# EAGLE design relay_control (EAGLE 9.6.2)
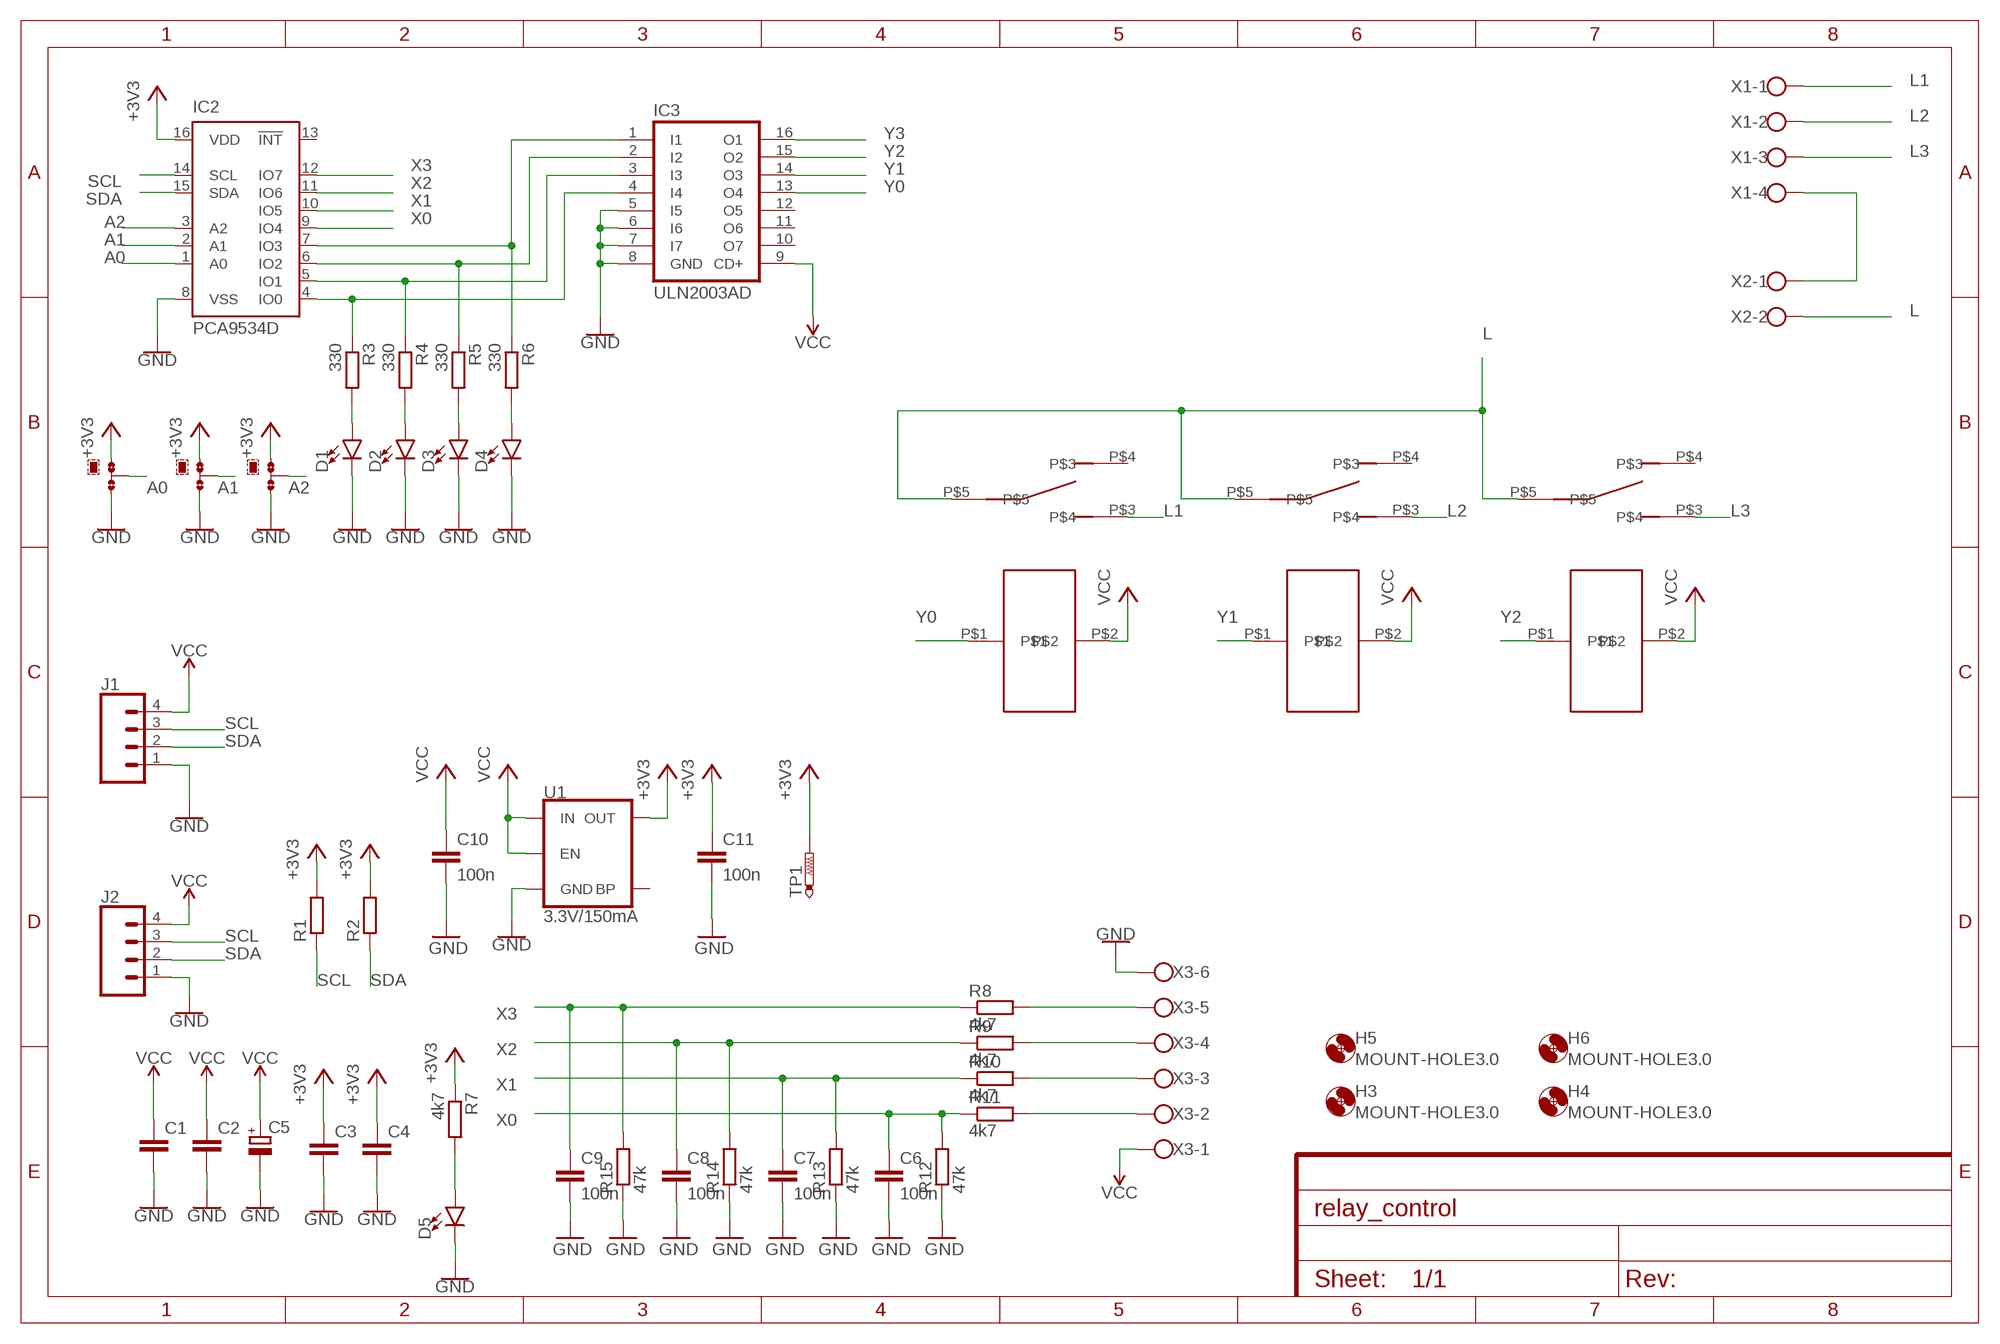
[diagram p0: schematic, sheet 1]

## Parts
C1  C-EUC0805  [C0805]
C2  C-EUC0805  [C0805]
C3  C-EUC0805  [C0805]
C4  C-EUC0805  [C0805]
C5  CPOL-EU150CLZ-1014  [150CLZ-1014]
C6  100n  C-EUC0805  [C0805]
C7  100n  C-EUC0805  [C0805]
C8  100n  C-EUC0805  [C0805]
C9  100n  C-EUC0805  [C0805]
C10  100n  C-EUC0805  [C0805]
C11  100n  C-EUC0805  [C0805]
D1  LED1206  [LED-1206]
D2  LED1206  [LED-1206]
D3  LED1206  [LED-1206]
D4  LED1206  [LED-1206]
D5  LED1206  [LED-1206]
H3  MOUNT-HOLE3.0  [3,0]
H4  MOUNT-HOLE3.0  [3,0]
H5  MOUNT-HOLE3.0  [3,0]
H6  MOUNT-HOLE3.0  [3,0]
IC2  PCA9534D  [SO16W]
IC3  ULN2003AD  [SO16]
J1  CONN_04POLAR  [MOLEX-1X4]
J2  CONN_04POLAR  [MOLEX-1X4]
JMP1  0R-JUMPA  [A0R-JMP]
JMP2  0R-JUMPA  [A0R-JMP]
JMP3  0R-JUMPA  [A0R-JMP]
R1  R-EU_M0805  [M0805]
R2  R-EU_M0805  [M0805]
R3  330  R-EU_M0805  [M0805]
R4  330  R-EU_M0805  [M0805]
R5  330  R-EU_M0805  [M0805]
R6  330  R-EU_M0805  [M0805]
R7  4k7  R-EU_M0805  [M0805]
R8  4k7  R-EU_M0805  [M0805]
R9  4k7  R-EU_M0805  [M0805]
R10  4k7  R-EU_M0805  [M0805]
R11  4k7  R-EU_M0805  [M0805]
R12  47k  R-EU_M0805  [M0805]
R13  47k  R-EU_M0805  [M0805]
R14  47k  R-EU_M0805  [M0805]
R15  47k  R-EU_M0805  [M0805]
TP1  PTR1B2,54  [B2,54]
U1  3.3V/150mA  V_REG_MIC52053.3V  [SOT23-5]
U$1  T9G_RELAY  [T9G_RELAY]
U$2  T9G_RELAY  [T9G_RELAY]
U$3  T9G_RELAY  [T9G_RELAY]
X1  W239-104  [W239-104]
X2  W239-302  [W239-302]
X3  W237-6  [W237-6]

## Nets
+3V3: C3.1 C4.1 C11.1 IC2.16(VDD) JMP1.1 JMP2.1 JMP3.1 R1.2 R2.2 R7.1 TP1.TP U1.5(OUT)
A0: IC2.1(A0) JMP1.2
A1: IC2.2(A1) JMP2.2
A2: IC2.3(A2) JMP3.2
GND: C1.2 C2.2 C3.2 C4.2 C5.- C6.2 C7.2 C8.2 C9.2 C10.2 C11.2 D1.C D2.C D3.C D4.C D5.C IC2.8(VSS) IC3.5(I5) IC3.6(I6) IC3.7(I7) IC3.8(GND) J1.1 J2.1 JMP1.3 JMP2.3 JMP3.3 R12.1 R13.1 R14.1 R15.1 U1.2(GND) X3.6
L: U$1.P$5 U$2.P$5 U$3.P$5 X2.2
L1: U$1.P$3 X1.1
L2: U$2.P$3 X1.2
L3: U$3.P$3 X1.3
N$1: IC2.4(IO0) IC3.4(I4) R3.1
N$2: D1.A R3.2
N$3: IC2.5(IO1) IC3.3(I3) R4.1
N$4: D2.A R4.2
N$5: IC2.6(IO2) IC3.2(I2) R5.1
N$6: D3.A R5.2
N$7: IC2.7(IO3) IC3.1(I1) R6.1
N$8: D4.A R6.2
N$9: D5.A R7.2
N$12: X1.4 X2.1
N$13: R11.2 X3.2
N$14: R10.2 X3.3
N$15: R9.2 X3.4
N$16: R8.2 X3.5
SCL: IC2.14(SCL) J1.3 J2.3 R1.1
SDA: IC2.15(SDA) J1.2 J2.2 R2.1
VCC: C1.1 C2.1 C5.+ C10.1 IC3.9(CD+) J1.4 J2.4 U1.1(IN) U1.3(EN) U$1.P$2 U$2.P$2 U$3.P$2 X3.1
X0: C6.1 IC2.9(IO4) R11.1 R12.2
X1: C7.1 IC2.10(IO5) R10.1 R13.2
X2: C8.1 IC2.11(IO6) R9.1 R14.2
X3: C9.1 IC2.12(IO7) R8.1 R15.2
Y0: IC3.13(O4) U$1.P$1
Y1: IC3.14(O3) U$2.P$1
Y2: IC3.15(O2) U$3.P$1
Y3: IC3.16(O1)
Unconnected: IC2.13(!INT) IC3.10(O7) IC3.11(O6) IC3.12(O5) U1.4(BP) U$1.P$4 U$2.P$4 U$3.P$4

## Library data of the parts
C1-C4 C6-C11 = rcl:C-EU: CAPACITOR, European symbol; SPICEPREFIX: C
C5 = rcl:CPOL-EU: POLARIZED CAPACITOR, European symbol; SPICEPREFIX: C
D1-D5 = SparkFun-LED:LED: LED (Generic) Standard schematic elements and footprints for 5mm, 3mm, 1206, and 0603 sized LEDs. Generic LEDs with no color specified.
H3-H6 = holes:MOUNT-HOLE: MOUNTING HOLE with drill center marker
IC2 = micro-philips:PCA9534: 8-bit I2C-bus and SMBus low power I/O port with interrupt Source: www.nxp.com .. PCA9534_3.pdf; MPN: PCA9534DB; OC_FARNELL: 1408284; OC_NEWARK: 18M7513
IC3 = uln-udn:ULN2003A: DRIVER ARRAY
J1 J2 = SparkFun-Connectors:CONN_04: Multi connection point. Often used as Generic Header-pin footprint for 0.1 inch spaced/style header connections On any of the 0.1 inch spaced packages, you can populate with these: Break Away Headers - Straight <https://www.sparkfun.com/products/116> (PRT-00116) Break Away Male Headers - Right Angle <https://www.sparkfun.com/products/553> (PRT-00553) Female Headers <https://www.sparkfun.com/products/115> (PRT-00115) Break Away Headers - Machine Pin <https://www.sparkfun.com/products/117> (PRT-00117) Break Away Female Headers - Swiss Machine Pin <https://www.sparkfun.com/products/743> (PRT-00743) For SCREWTERMINALS and SPRING TERMINALS visit here: Screw Terimnals on SparkFun.com <https://www.sparkfun.com/search/results?term=Screw+Terminals> (5mm/3.5mm/2.54mm spacing) This device is also useful as a general connection point to wire up your design to another part of your project. Our various solder wires solder well into these plated through hole pads. Hook-Up Wire - Assortment (Stranded, 22 AWG) <https://www.sparkfun.com/products/11375> (PRT-11375) Hook-Up Wire - Assortment (Solid Core, 22 AWG) <https://www.sparkfun.com/products/11367> (PRT-11367) View the entire wire category on our website here <https://www.sparkfun.com/categories/141> Special notes: Molex polarized connector foot print use with SKU : PRT-08231 with associated crimp pins and housings. 1MM SMD Version SKU: PRT-10208; PROD_ID: CONN-08186; SF_ID: PRT-08231
JMP1-JMP3 = jump-0r-smd:0R-JUMP: SMD 0R 0805 Jumper
R1-R15 = rcl:R-EU_: RESISTOR, European symbol; SPICEPREFIX: R
TP1 = testpad:PTR1: TEST PIN
U1 = SparkFun-IC-Power:V_REG_MIC5205: V_REG MIC5205 Standard 3.3V, 5V, and Adjustable 150mA LDO voltage regulator in SOT-23 layout. Micrel part MIC5205. BP (by-pass) pin is used to lower output noise with 470pF cap, may be left open. On the adjustable version BP is used to set output.; PROD_ID: VREG-00822
U$1-U$3 = my_library:T9G_RELAY
X1 = con-wago-500:W239-104: WAGO SCREW CLAMP; OC_FARNELL: unknown; OC_NEWARK: unknown
X2 = con-wago-500:W239-302: WAGO SCREW CLAMP; OC_FARNELL: unknown; OC_NEWARK: unknown
X3 = con-wago-500:W237-6: WAGO SCREW CLAMP; OC_FARNELL: unknown; OC_NEWARK: unknown

## Board
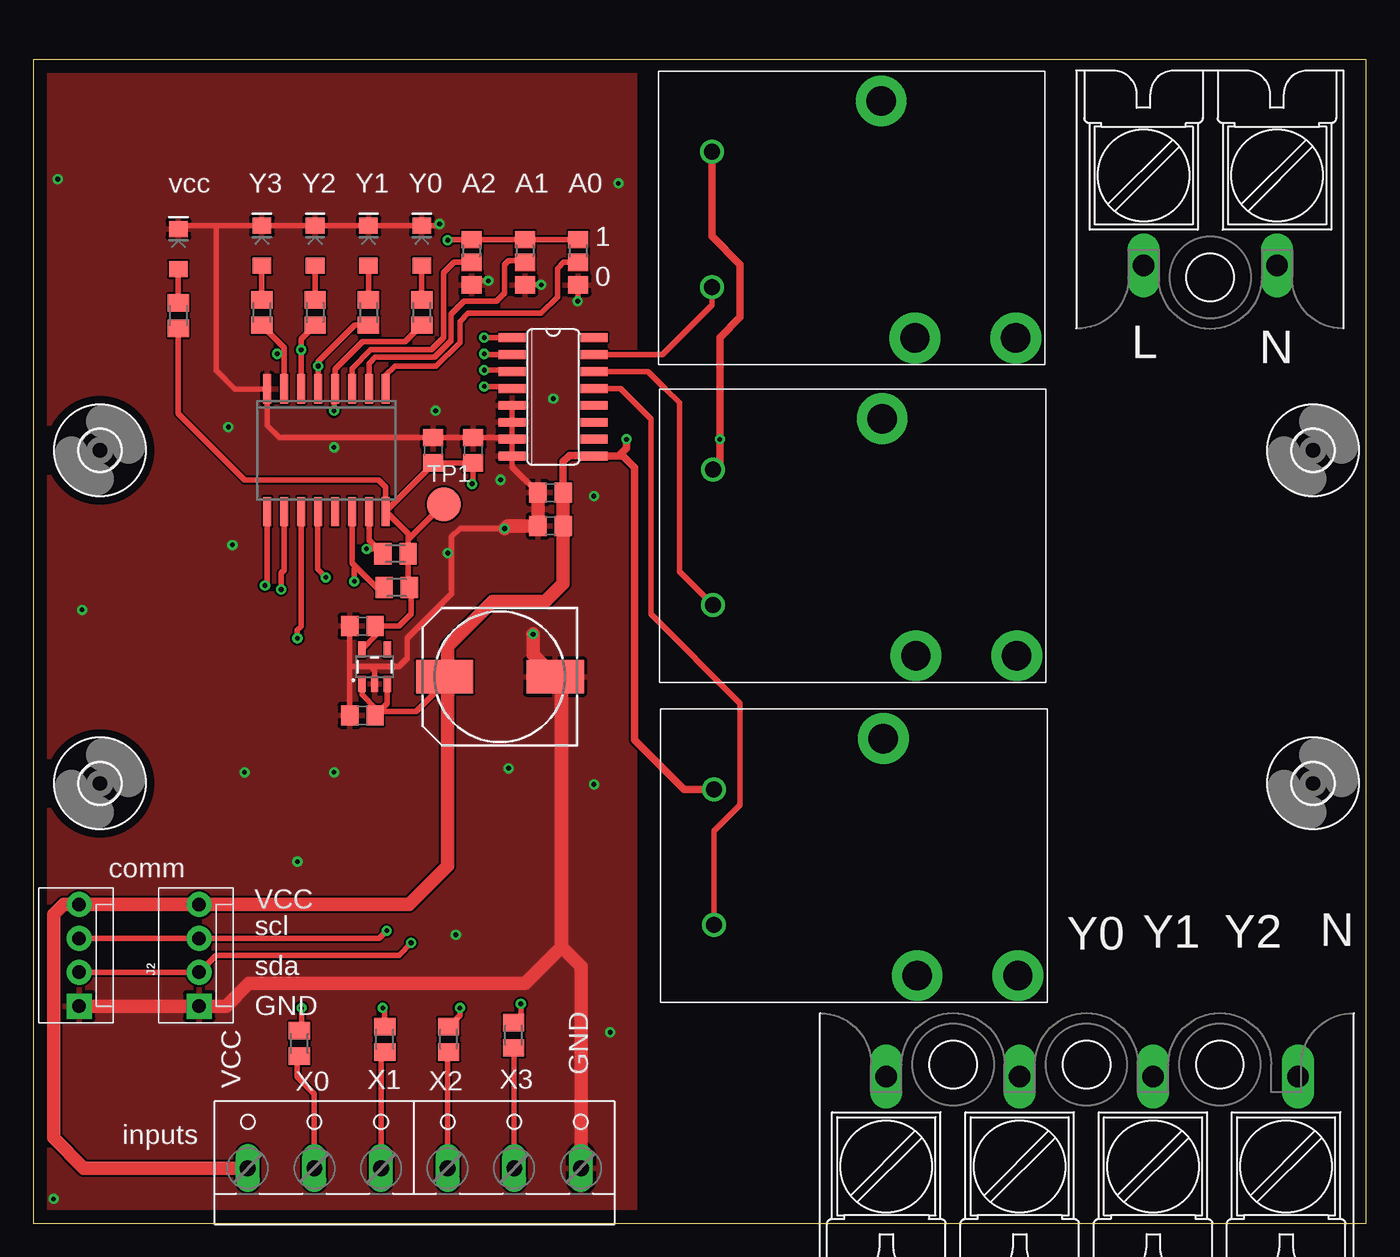
[diagram p1: board, top side]
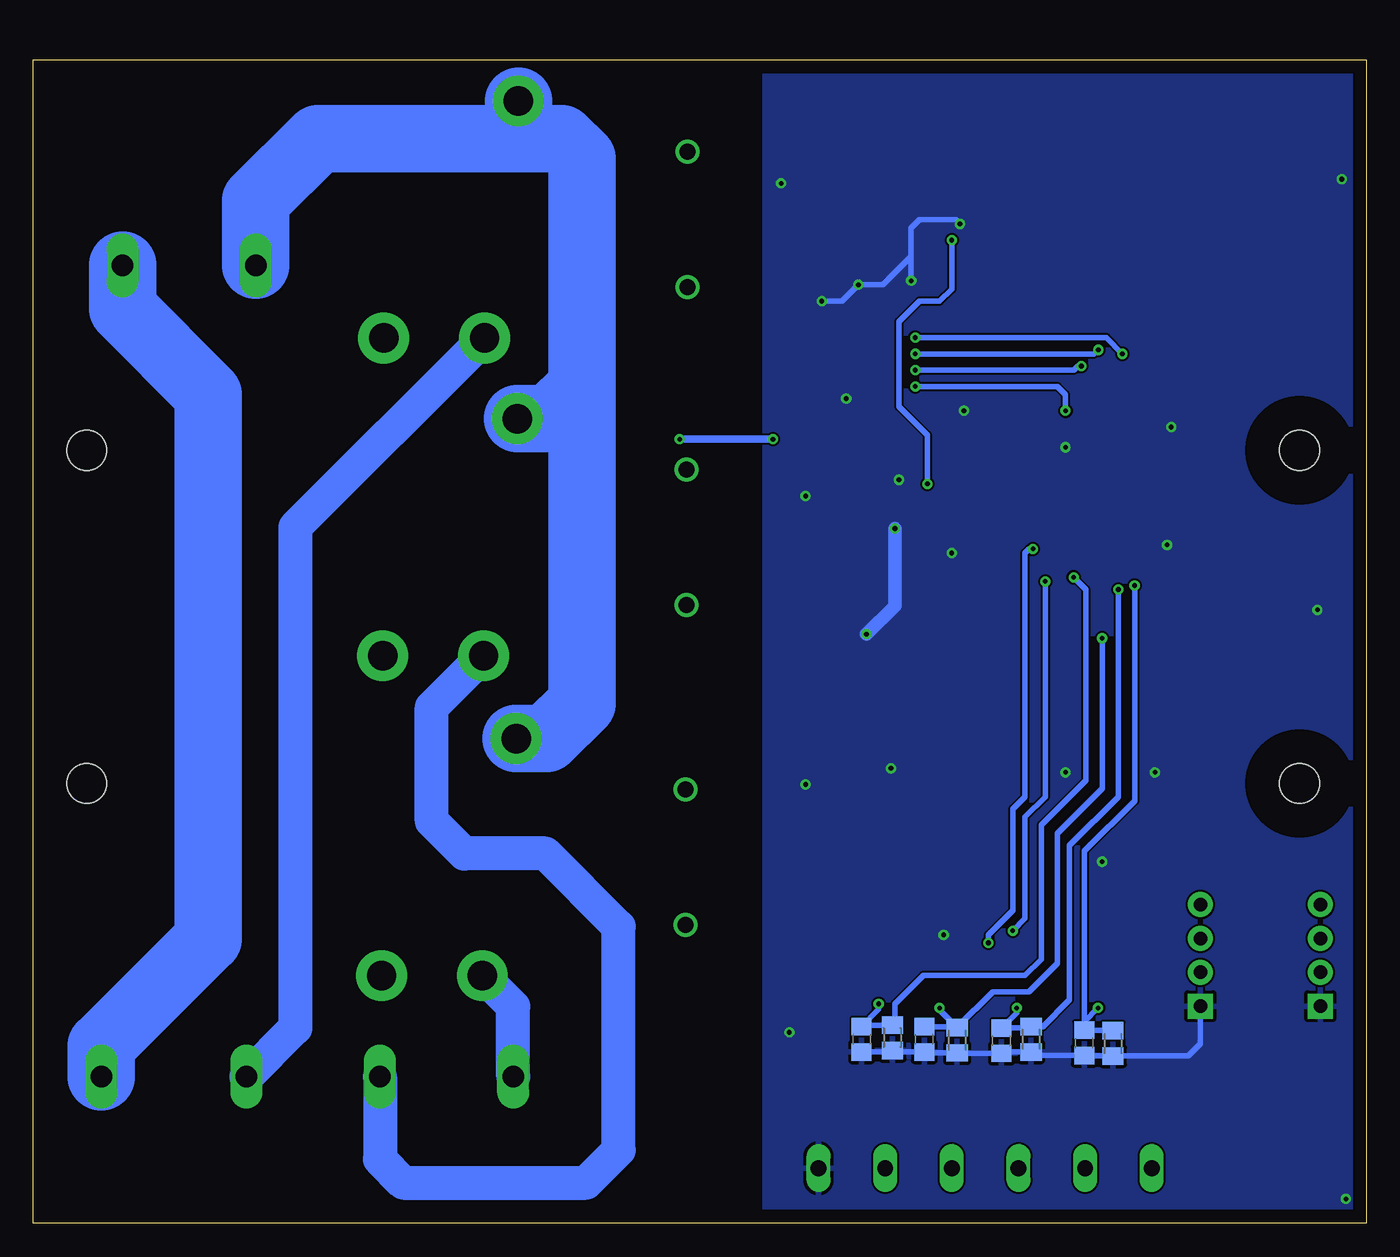
[diagram p2: board, bottom side, seen from below]

Size 100 x 87.3 mm. Coordinates in mm from the lower left corner, seen from the top.
Outline: 0,0 100,0 100,87.31 0,87.31 0,0
Copper layers (1*16): Top 0.035mm / dielectric 1.5mm / Bottom 0.035mm
Design rules "default": minimum track width 6mil, minimum drill 0.35mm, track to track 6mil, track to pad 6mil, pad to pad 6mil, via to via 6mil, smd to smd 6mil, copper to edge 40mil, drill to drill 6mil, minimum pad ring 10mil, minimum via ring 8mil, stop-mask expansion 4mil, vias tented up to drill 0mil, thermal gap 10mil

### Footprints (pad centres in the part's own frame; a part is rotated, then mirrored left to right if it is on the bottom)
C0805 = smd 1.3 x 1.5: 1 -0.95,0; 2 0.95,0
150CLZ-1014 = smd 4.3 x 2.5: + 4.15,0; - -4.15,0
LED-1206 = smd 1.2 x 1.4: A -1.5,0; C 1.5,0
3,0 = hole 3: 0,0
SO16W = smd 0.6 x 2.2: 1 -4.445,-4.6; 2 -3.175,-4.6; 3 -1.905,-4.6; 4 -0.635,-4.6; 5 0.635,-4.6; 6 1.905,-4.6; 7 3.175,-4.6; 8 4.445,-4.6; 9 4.445,4.6; 10 3.175,4.6; 11 1.905,4.6; 12 0.635,4.6; 13 -0.635,4.6; 14 -1.905,4.6; 15 -3.175,4.6; 16 -4.445,4.6
SO16 = smd 0.66 x 2.032: 1 -4.445,-3.073; 2 -3.175,-3.073; 3 -1.905,-3.073; 4 -0.635,-3.073; 5 0.635,-3.073; 6 1.905,-3.073; 7 3.175,-3.073; 8 4.445,-3.073; 9 4.445,3.073; 10 3.175,3.073; 11 1.905,3.073; 12 0.635,3.073; 13 -0.635,3.073; 14 -1.905,3.073; 15 -3.175,3.073; 16 -4.445,3.073
MOLEX-1X4 = drill 1.016 pad 1.88 square: 1 0,0 | drill 1.016 pad 1.88: 2 2.54,0; 3 5.08,0; 4 7.62,0
A0R-JMP = smd 1.5 x 1.3: 1 0,1.7; 2 0,0; 3 0,-1.7
M0805 = smd 1.3 x 1.6: 1 -0.95,0; 2 0.95,0
B2,54 = smd 2.54 x 2.54: TP 0,0
SOT23-5 = smd 0.55 x 1.2: 1 -0.95,-1.3; 2 0,-1.3; 3 0.95,-1.3; 4 0.95,1.3; 5 -0.95,1.3
T9G_RELAY = drill 1.2: P$1 16.19,4; P$2 6.03,4 | drill 2.2 pad 3.81: P$3 20,19.24; P$4 20,26.8; P$5 2.22,16.7
W239-104 = drill 1.6 long: 1 -15,5; 2 -5,5; 3 5,5; 4 15.9,5
W239-302 = drill 1.6 long: 1 -5,5; 2 5,5
W237-6 = drill 1.194 long: 1 -12.5,-1.27; 2 -7.5,-1.27; 3 -2.5,-1.27; 4 2.5,-1.27; 5 7.5,-1.27; 6 12.5,-1.27

### Placement (x,y rotation side)
C1  38.81,52.33 180 top
C2  38.81,54.81 180 top
C3  30,58 90 top
C4  33,58 90 top
C5  35,41 180 top
C6  21.15,13.53 270 bottom
C7  27.37,13.7 270 bottom
C8  33.16,13.8 270 bottom
C9  37.86,13.8 270 bottom
C10  24.69,38.1 180 top
C11  24.69,44.81 180 top
D1  29.14,73.33 90 top
D2  25.14,73.33 90 top
D3  21.14,73.33 90 top
D4  17.14,73.33 90 top
D5  10.88,73.1 90 top
H3  5,33 0 top
H4  5,58 0 top
H5  96,58 0 top
H6  96,33 0 top
IC2  22,58 180 top
IC3  39,62 270 top
J1  3.44,16.29 90 top
J2  12.44,16.29 90 top
JMP1  40.88,72.1 0 top
JMP2  36.88,72.1 0 top
JMP3  32.88,72.1 0 top
R1  27.27,47.7 0 top
R2  27.17,50.23 0 top
R3  29.14,68.33 90 top
R4  25.14,68.33 90 top
R5  21.14,68.33 90 top
R6  17.14,68.33 90 top
R7  10.88,68.1 90 top
R8  36.03,14.11 270 top
R9  31.16,13.8 270 top
R10  26.37,13.8 270 top
R11  19.96,13.5 270 top
R12  19,13.5 90 bottom
R13  25.15,13.8 90 bottom
R14  30.69,13.73 90 bottom
R15  35.55,13.91 90 bottom
TP1  30.78,53.95 0 top
U1  25.6,41.76 0 top
U$1  47.07,38.58 270 top
U$2  46.98,62.58 270 top
U$3  46.91,86.42 270 top
X1  79,6 0 top
X2  88.3,76.88 180 top
X3  28.58,5.4 0 top

### Tracks (layer width: path | path; a pad name or v marks a point on that pad's centre or on a via)
+3V3  (via drill 0.35)
  Top 0.406: R2.2 28.12,47.79 R1.2 28.35,47.57 28.35,45.72 27.43,44.81 C11.1 25.64,44.04 U1.5 | IC2.16 28.12,51.74 R2.2 | IC2.16 26.45,55.24 25.91,55.78 15.85,55.78 10.88,60.75 R7.1 | JMP1.1 JMP2.1 JMP3.1 31.13,73.8 v31.09,73.76 | IC2.16 30,56.95 C3.1 C4.1 33,55.55 v32.92,55.47 | TP1.TP 28.12,51.28 R2.2
  Bottom 0.406: v32.92,55.47 32.92,59.13 35.05,61.27 35.05,67.67 33.53,69.19 32,69.19 31.09,70.1 v31.09,73.76
A0
  Top 0.406: IC2.1 26.45,63.63 27.13,64.31 30.23,64.31 32,66.08 32,67.67 32.61,68.28 38.1,68.28 39.32,69.49 39.32,71.63 39.79,72.1 JMP1.2
A1
  Top 0.406: IC2.2 25.18,64.49 25.65,64.97 30.1,64.97 31.34,66.22 31.34,68.22 32.31,69.19 34.75,69.19 35.36,69.8 35.36,71.93 35.66,72.24 36.75,72.24 JMP2.2
A2
  Top 0.406: IC2.3 23.91,64.14 25.3,65.53 29.87,65.53 30.79,66.45 30.79,71.32 31.57,72.1 JMP3.2
GND  (via drill 0.35)
  Top 0.406: D5.C 11.11,74.83 13.72,74.83 | 13.72,74.83 D4.C D3.C D2.C D1.C 30.33,74.83 v30.48,74.98 | 13.72,74.83 13.72,64.01 15.12,62.6 IC2.8 17.55,59.86 18.47,58.95 C3.2 C4.2 35.8,58.95 IC3.7 | JMP3.3 33.19,70.71 v34.14,70.71 | JMP2.3 v38.1,70.41 | JMP1.3 40.88,69.23 v40.84,69.19 | IC3.7 IC3.8 35.93,56.75 C2.2 | IC3.7 IC3.6 IC3.5 | C10.2 23.74,41.76 | 23.74,41.76 C11.2 | U1.2 25.6,41.45 25.3,41.76 | 23.74,41.76 25.3,41.76 | 25.3,41.76 27.43,41.76 28.04,42.37 28.04,43.89 31.39,47.24 31.39,51.51 32,52.12 v35.36,52.12
  Top 1.016: J1.1 J2.1 14.46,16.29 16.15,17.98 36.88,17.98 39.62,20.73 | v35.36,52.12 35.56,52.33 C1.2 C2.2 | v37.49,44.2 37.49,42.66 C5.- 39.3,41.15 39.62,41.15 39.62,20.73 | X3.6 41.09,19.27 39.62,20.73
  Bottom 0.406: v34.14,70.71 34.14,72.54 | 34.14,72.54 34.14,74.68 33.53,75.29 30.79,75.29 v30.48,74.98 | 34.14,72.54 36.27,70.41 v38.1,70.41 39.32,69.19 v40.84,69.19 | 35.52,12.94 35.43,12.85 C8.2 33.09,12.78 R14.1 30.65,12.74 C7.2 27.26,12.85 R13.1 24.88,12.58 C6.2 21.11,12.55 R12.1 13.36,12.55 12.44,13.47 J2.1 | 35.52,12.94 R15.1 | C9.2 35.61,12.85 35.52,12.94
  Bottom 1.016: v37.49,44.2 35.36,46.33 v35.36,52.12 | 3.58,16.15 J1.1
  other vias: 1.52,1.83 1.83,78.33 15.85,33.83 22.56,33.83 31.7,21.64 35.66,34.14 42.06,32.92 43.28,14.33 19.81,27.13 14.63,59.74 14.94,50.9 3.66,46.02 42.06,54.56 43.89,78.03 30.18,60.96 31.09,50.29 35.05,55.78 22.56,58.22 39.01,61.87
  pour Bottom: -0.61,88.7 45.11,88.7 45.11,-2.13 -0.61,-2.13
  pour Top: -0.61,89.31 45.11,89.31 45.11,-1.83 -0.61,-1.83
L
  Bottom 2.54: X2.2 83.27,71.88
  Bottom 5.08: U$2.P$5 61.25,60.37 58.83,62.79 | 58.83,62.79 58.83,79.86 60.35,81.38 62.48,81.38 | 62.48,81.38 78.64,81.38 83.31,76.72 X2.2 | U$3.P$5 63.61,82.51 62.48,81.38 | U$1.P$5 61.48,36.37 58.83,39.01 58.83,62.79
L1
  Bottom 2.54: X1.1 64,16.27 U$1.P$3
L2
  Bottom 2.54: U$2.P$3 70.1,38.7 70.1,30.18 67.67,27.74 61.57,27.74 56.08,22.25 56.08,5.49 58.52,3.05 72.24,3.05 74,4.81 X1.2
L3
  Bottom 2.54: X1.3 80.34,14.66 80.34,52.23 U$3.P$3
N$1  (via drill 0.35)
  Top 0.406: IC2.4 22.64,62.79 | 22.64,62.79 22.64,64.09 24.69,66.14 27.9,66.14 R3.1 | IC3.4 35.77,62.79 v33.83,62.79 | v22.55,60.96 22.55,62.71 22.64,62.79
  Bottom 0.406: v33.83,62.79 23.16,62.79 22.55,62.18 v22.55,60.96
N$2
  Top 0.406: R3.2 D1.A
N$3  (via drill 0.35)
  Top 0.406: R4.1 24.1,67.38 21.36,64.65 v21.36,64.31 IC2.5 | IC3.3 35.82,64.01 v33.83,64.01
  Bottom 0.406: v33.83,64.01 21.95,64.01 21.64,64.31 v21.36,64.31
N$4
  Top 0.406: D2.A R4.2
N$5  (via drill 0.35)
  Top 0.406: R5.1 20.09,66.33 v20.09,65.53 IC2.6 | IC3.2 33.88,65.17 v33.83,65.23
  Bottom 0.406: v33.83,65.23 20.42,65.23 20.12,65.53 v20.09,65.53
N$6
  Top 0.406: R5.2 D3.A
N$7  (via drill 0.35)
  Top 0.406: IC2.7 18.82,65.23 | 18.82,65.23 18.82,65.7 R6.1 | IC3.1 34.14,66.44 34.14,66.45 v33.83,66.45 | v18.29,65.23 18.82,65.23
  Bottom 0.406: v33.83,66.45 19.51,66.45 v18.29,65.23
N$8
  Top 0.406: R6.2 D4.A
N$9
  Top 0.406: R7.2 D5.A
N$12
  Bottom 5.08: X1.4 94.9,13.3 86.87,21.34 86.87,62.18 93.31,68.62 X2.1
N$13
  Top 0.406: X3.2 21.09,9.7 19.81,10.97 19.81,12.39 R11.2
N$14
  Top 0.406: X3.3 26.09,12.57 R10.2
N$15
  Top 0.406: X3.4 31.09,12.78 R9.2
N$16
  Top 0.406: X3.5 36.09,13.11 R8.2
SCL  (via drill 0.35)
  Top 0.406: IC2.14 23.91,49.55 24.23,49.23 | R1.1 25.76,47.7 24.23,49.23 | v24.08,48.16 24.08,49.07 24.23,49.23 | J1.3 J2.3 25.94,21.37 v26.52,21.95
  Bottom 0.406: v24.08,48.16 24.08,32 25.6,30.48 25.6,22.86 v26.52,21.95
SDA  (via drill 0.35)
  Top 0.406: IC2.15 25.18,51.27 R2.1 25.85,50.6 v24.99,50.6 | J1.2 J2.2 13.73,20.12 27.43,20.12 v28.35,21.03
  Bottom 0.406: v24.99,50.6 25.3,50.6 25.6,50.29 25.6,32 26.52,31.09 26.52,23.47 28.35,21.64 v28.35,21.03
VCC  (via drill 0.35)
  Top 0.406: 39.76,52.43 C1.1 | U1.1 24.65,39.66 25.64,38.67 C10.1 25.94,38.41 | 31.09,40.76 28.73,38.41 25.94,38.41 | U1.3 26.55,39.01 25.94,38.41
  Top 0.559: C2.1 39.76,57.13 40.23,57.61 42.02,57.61 IC3.9 43.89,57.55 | 43.89,57.55 44.25,57.55 45.11,56.69 45.11,36.27 48.83,32.55 U$1.P$2 | 43.89,57.55 44.5,58.16 v44.5,58.83 | U$2.P$2 51.51,57.08 v51.51,58.83 51.51,66.45 53.03,67.97 53.03,71.93 50.9,74.07 U$3.P$2
  Top 1.016: 31.09,40.76 C5.+ | C2.1 39.76,52.43 | C1.1 39.76,47.99 38.41,46.63 34.44,46.63 31.09,43.28 31.09,40.76 | 31.09,40.76 31.09,26.82 28.18,23.91 J2.4 J1.4 2.27,23.91 1.52,23.16 1.52,6.4 3.79,4.13 X3.1
  Bottom 0.559: v44.5,58.83 v51.51,58.83
  Bottom 0.762: 3.27,24.08 J1.4
X0  (via drill 0.35)
  Top 0.406: R11.1 20.12,14.6 v20.12,16.15 | IC2.9 17.55,48.03 v17.37,47.85
  Bottom 0.406: R12.2 19.04,14.48 C6.1 | v20.12,16.15 21.15,15.12 C6.1 | C6.1 21.15,27.92 17.37,31.7 v17.37,47.85
X1  (via drill 0.35)
  Top 0.406: IC2.10 18.82,49 18.59,48.77 v18.59,47.55 | v26.21,16.15 26.37,16 R10.1
  Bottom 0.406: v26.21,16.15 26.21,15.8 C7.1 25.25,14.64 R13.2 24.26,14.75 22.25,16.76 22.25,28.35 18.59,32 v18.59,47.55
X2  (via drill 0.35)
  Top 0.406: IC2.11 20.09,44.78 19.81,44.5 v19.81,43.89 | v32,16.15 32,15.6 R9.1
  Bottom 0.406: C8.1 30.76,14.75 R14.2 | R14.2 32,16 v32,16.15 | R14.2 28,17.37 25.3,17.37 23.16,19.51 23.16,29.26 19.81,32.61 v19.81,43.89
X3  (via drill 0.35)
  Top 0.406: v36.58,16.46 36.58,15.6 R8.1 | v21.95,48.46 21.34,49.07 21.34,53.37 IC2.12
  Bottom 0.406: v36.58,16.46 36.58,16.04 C9.1 37.75,14.86 R15.2 35.36,15.05 35.36,16.46 33.22,18.59 25.6,18.59 24.38,19.81 24.38,29.87 21.03,33.22 21.03,47.55 v21.95,48.46
Y0
  Top 0.406: IC3.13 44.05,62.63 46.33,60.35 46.33,45.72 53.03,39.01 53.03,31.39 51.07,29.43 U$1.P$1
Y1
  Top 0.406: U$2.P$1 48.46,48.91 48.46,61.57 47.4,62.64 46.13,63.91 IC3.14
Y2
  Top 0.406: 43.84,65.17 IC3.15 47.19,65.17 50.91,68.89 U$3.P$1

### Text on the board
tNames: vcc | Y3 | Y2 | Y1 | Y0 | A2 | A1 | A0 | 1 | 0 | L | N | comm | VCC | scl | Y0 | Y1 | Y2 | N | sda | GND | GND | VCC | X0 | X1 | X2 | X3 | inputs